# EAGLE design ControlBoard (EAGLE 9.6.2)
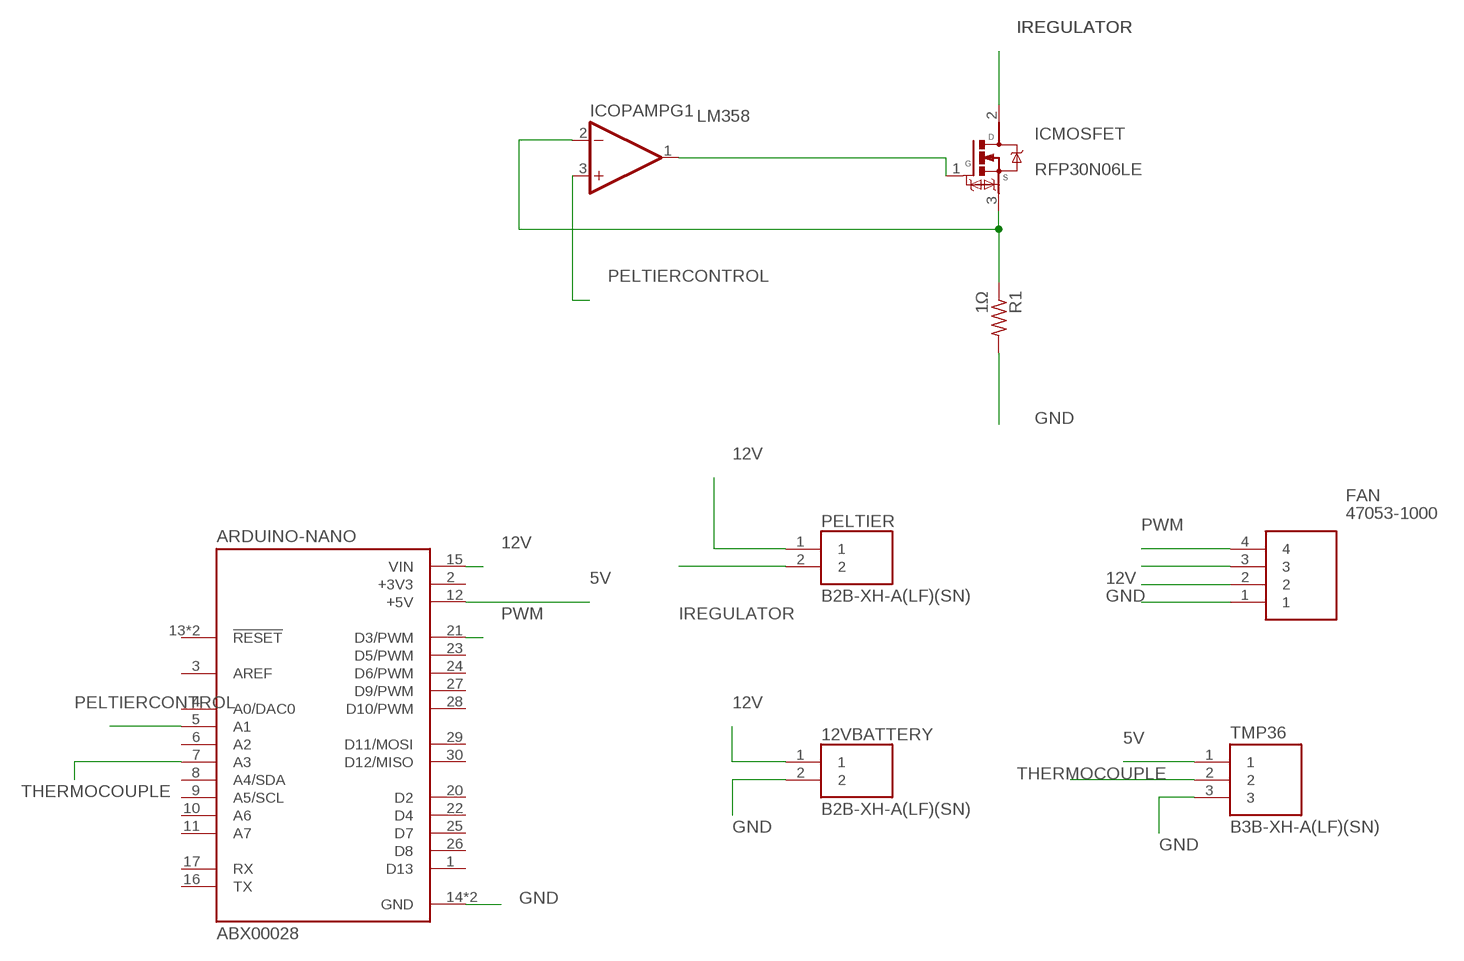
[diagram p0: schematic, sheet 1]

## Parts
12VBATTERY  B2B-XH-A(LF)(SN)  [JST_B2B-XH-A(LF)(SN)]
ARDUINO-NANO  ABX00028  [MODULE_ABX00028]
FAN  47053-1000  [470531000]
ICMOSFET  RFP30N06LE  [TRANS_RFP30N06LE]
ICOPAMP  LM358  [DIP08]
PELTIER  B2B-XH-A(LF)(SN)  [JST_B2B-XH-A(LF)(SN)]
R1  1Ω  FLIPFLOP-RES  [0805-THM]
TMP36  B3B-XH-A(LF)(SN)  [JST_B3B-XH-A(LF)(SN)]

## Nets
5V: ARDUINO-NANO.12(+5V) TMP36.1
12V: 12VBATTERY.1 ARDUINO-NANO.15(VIN) FAN.2 PELTIER.1
GND: 12VBATTERY.2 ARDUINO-NANO.14(GND) ARDUINO-NANO.19(GND) FAN.1 R1.2 TMP36.3
IREGULATOR: ICMOSFET.2(D) PELTIER.2
N$1: ICMOSFET.3(S) ICOPAMP.2(-IN) R1.1
N$3: FAN.3
N$5: ICMOSFET.1(G) ICOPAMP.1(OUT)
PELTIERCONTROL: ARDUINO-NANO.5(A1) ICOPAMP.3(+IN)
PWM: ARDUINO-NANO.21(D3/PWM) FAN.4
THERMOCOUPLE: ARDUINO-NANO.7(A3) TMP36.2
Unconnected: ARDUINO-NANO.1(D13) ARDUINO-NANO.3(AREF) ARDUINO-NANO.4(A0/DAC0) ARDUINO-NANO.6(A2) ARDUINO-NANO.8(A4/SDA) ARDUINO-NANO.9(A5/SCL) ARDUINO-NANO.10(A6) ARDUINO-NANO.11(A7) ARDUINO-NANO.13(!RESET) ARDUINO-NANO.16(TX) ARDUINO-NANO.17(RX) ARDUINO-NANO.18(!RESET) ARDUINO-NANO.20(D2) ARDUINO-NANO.22(D4) ARDUINO-NANO.23(D5/PWM) ARDUINO-NANO.24(D6/PWM) ARDUINO-NANO.25(D7) ARDUINO-NANO.26(D8) ARDUINO-NANO.27(D9/PWM) ARDUINO-NANO.28(D10/PWM) ARDUINO-NANO.29(D11/MOSI) ARDUINO-NANO.30(D12/MISO) ICOPAMP.4(P$V-) ICOPAMP.5(+IN) ICOPAMP.6(-IN) ICOPAMP.7(OUT) ICOPAMP.8(P$V+)

## Power pins joined to a net without a drawn wire
+3V3: ARDUINO-NANO.2(+3V3)

## Library data of the parts
12VBATTERY PELTIER = B2B-XH-A_LF__SN_:B2B-XH-A(LF)(SN): Connector Header Through Hole 2 position 0.098" (2.50mm) Check prices <https://pricing.snapeda.com/parts/B2B-XH-A%28LF%29%28SN%29/JST%20Sales/view-part?ref=eda> Check availability <https://pricing.snapeda.com/parts/B2B-XH-A%28LF%29%28SN%29/JST%20Sales/view-part?ref=eda>; AVAILABILITY: In Stock; DESCRIPTION: Connector Header Through Hole 2 position 0.098 (2.50mm); MF: JST Sales; MP: B2B-XH-A(LF)(SN); PACKAGE: None; PRICE: None; PURCHASE-URL: https://pricing.snapeda.com/search/part/B2B-XH-A(LF)(SN)/?ref=eda
ARDUINO-NANO = ABX00028:ABX00028: ATmega4809 Arduino Nano Every AVR AVR MCU 8-Bit Embedded Evaluation Board Check availability <https://pricing.snapeda.com/parts/Arduino%20Nano%20Every/Arduino/view-part?ref=eda>; AVAILABILITY: In Stock; DESCRIPTION: Arduino’s 5V compatible board in the smallest available form factor: 45x18mm!; MF: Arduino; MP: Arduino Nano Every; PACKAGE: None; PRICE: None; PURCHASE-URL: https://pricing.snapeda.com/search/part/Arduino Nano Every/?ref=eda
FAN = 47053-1000:47053-1000: MOLEX - 47053-1000 - HEADER, 4POS, 1ROW, 2.54MM Source: Datasheet <http://www.molex.com/pdm_docs/sd/470531000_sd.pdf> Check availability <https://pricing.snapeda.com/parts/470531000/Molex/view-part?ref=eda>; AVAILABILITY: In Stock; DESCRIPTION: Conn Wire to Board HDR 4 POS 2.54mm Solder ST Thru-Hole KK® Bag; MF: Molex; MP: 470531000; PACKAGE: None; PRICE: None; PURCHASE-URL: https://pricing.snapeda.com/search/part/470531000/?ref=eda
ICMOSFET = RFP30N06LE:RFP30N06LE: Mosfet n-Ch 60v 30a To-220ab - Rfp30n06le Check availability <https://pricing.snapeda.com/parts/RFP30N06LE/ON/view-part?ref=eda>; AVAILABILITY: Not in stock; DESCRIPTION: N-Channel 60 V 30A (Ta) 96W (Tc) Through Hole TO-220-3; MF: ON; MP: RFP30N06LE; PACKAGE: TO-220 Fairchild Semiconductor; PRICE: None
ICOPAMP = LM358:LM358: LM358 Jellybean op-amp Datasheet <http://www.sparkfun.com/datasheets/Components/General/LM358.pdf> SparkFun Products Op-Amp (Thru-Hole) - LM358 <https://www.sparkfun.com/products/9456> (COM-09456) Check availability <https://pricing.snapeda.com/parts/LM358/Texas%20Instruments/view-part?ref=eda>; AVAILABILITY: In Stock; DESCRIPTION: General Purpose Amplifier 2 Circuit - 8-TSSOP; MF: Texas Instruments; MP: LM358; PACKAGE: None; PRICE: None; PURCHASE-URL: https://pricing.snapeda.com/search/part/LM358/?ref=eda
R1 = adafruit:FLIPFLOP-RES: Flip Flop resistor An 0805 resistor inside a standard 1/4W 5% resistor. Makes for easy mods
TMP36 = B3B-XH-A_LF__SN_:B3B-XH-A(LF)(SN): Connector Header Through Hole 3 position 0.098" (2.50mm) Check prices <https://pricing.snapeda.com/parts/B3B-XH-A%28LF%29%28SN%29/JST%20Sales/view-part?ref=eda> Check availability <https://pricing.snapeda.com/parts/B3B-XH-A%28LF%29%28SN%29/JST%20Sales/view-part?ref=eda>; AVAILABILITY: In Stock; DESCRIPTION: Connector Header Through Hole 3 position 0.098 (2.50mm); MF: JST Sales; MP: B3B-XH-A(LF)(SN); PACKAGE: None; PRICE: None

## Board
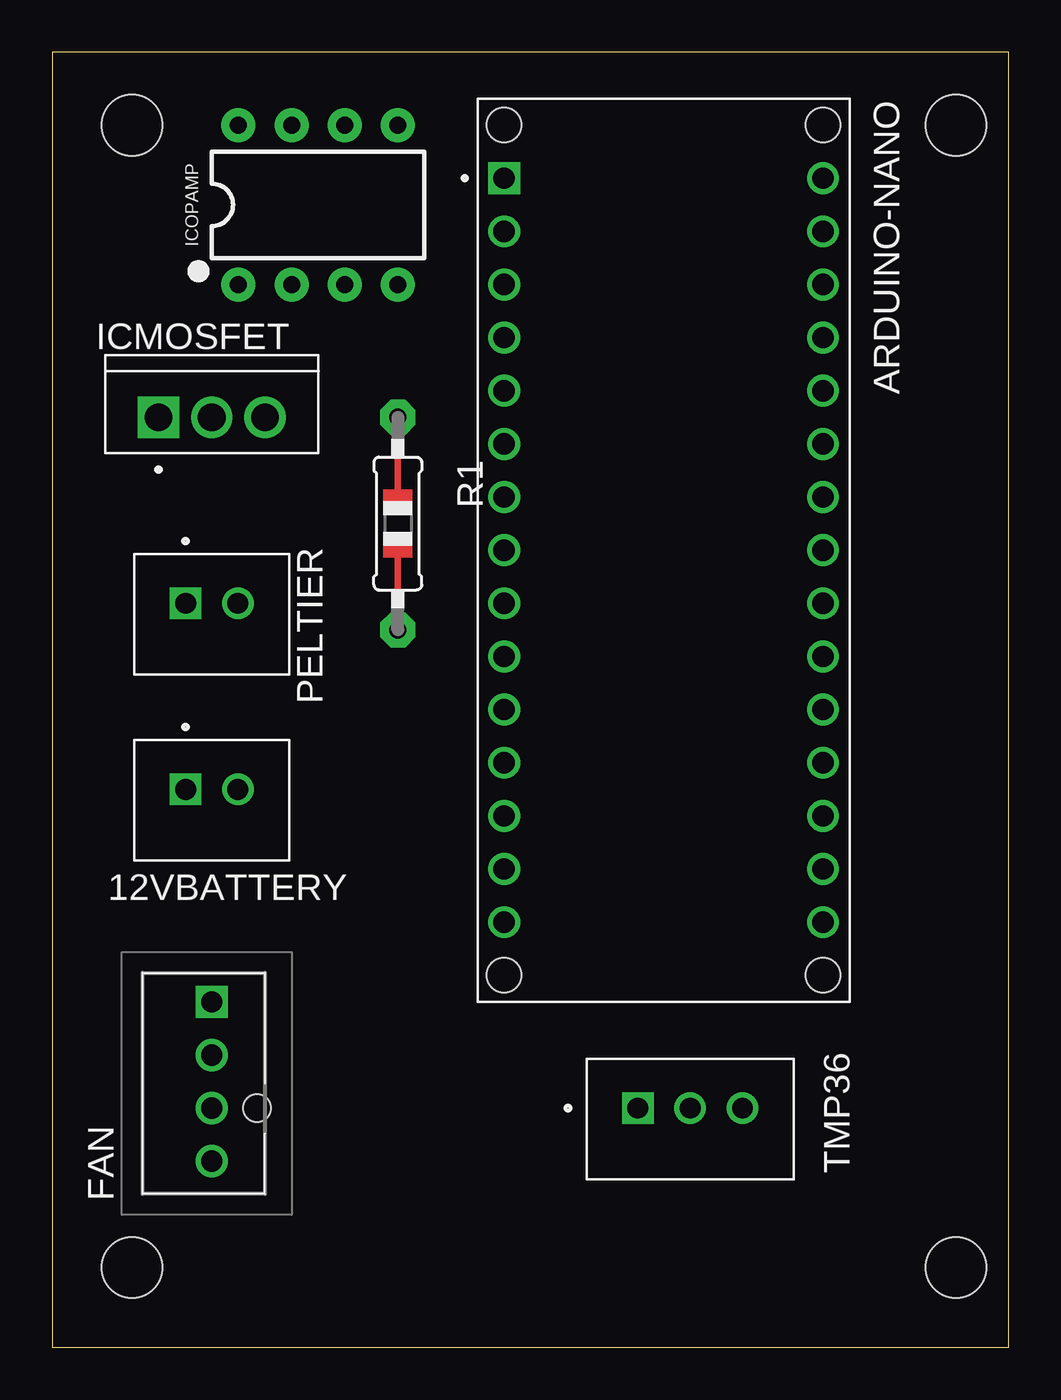
[diagram p1: board, top side]
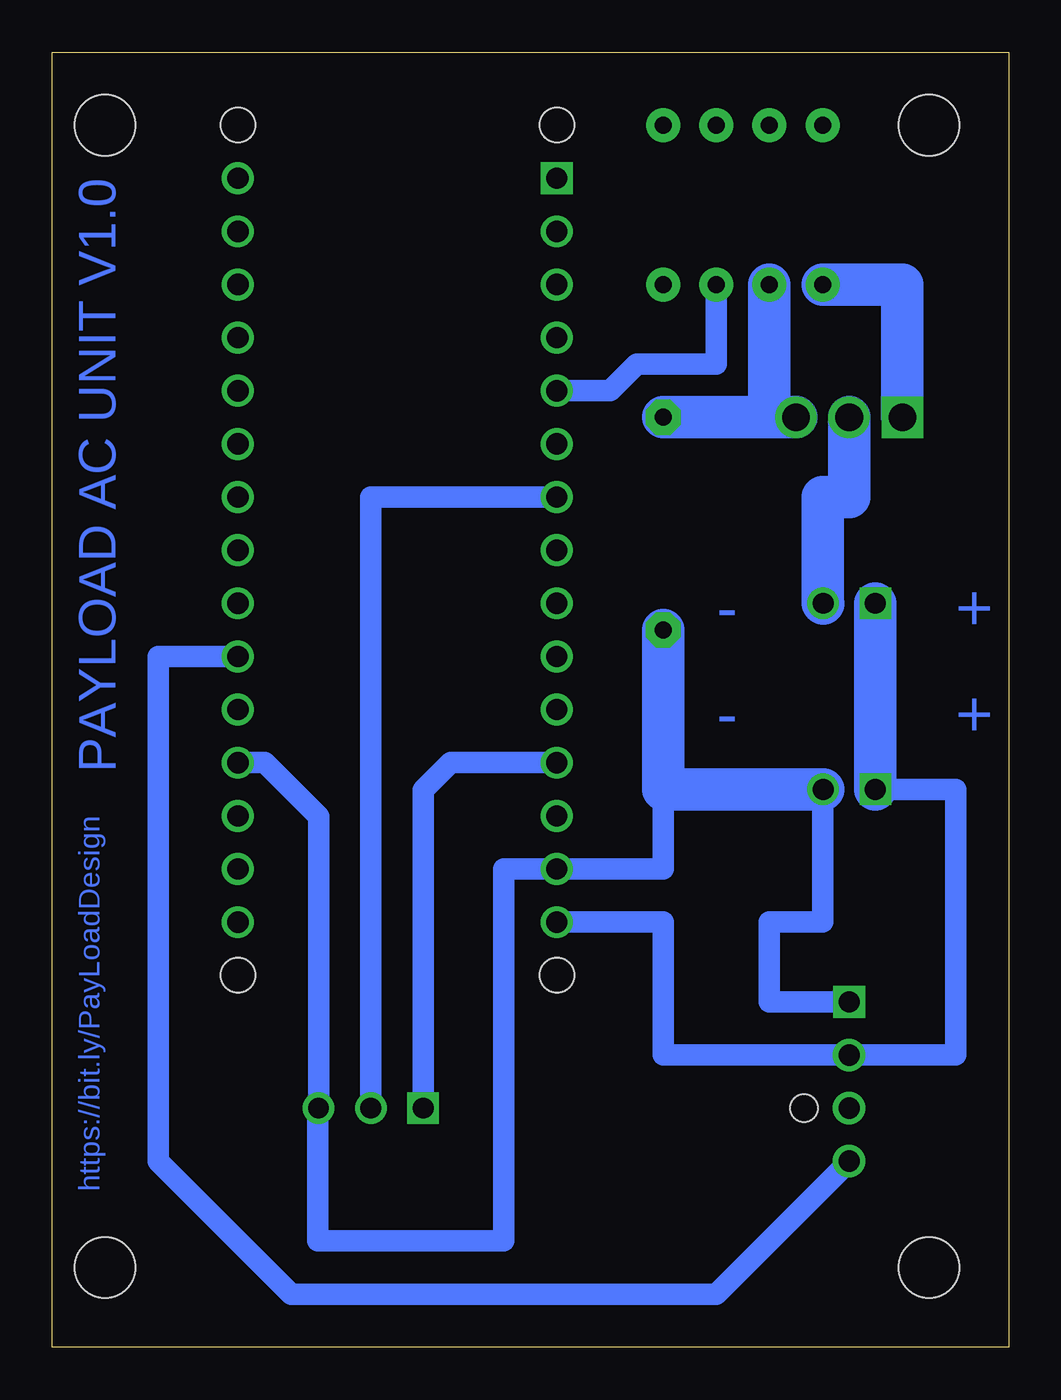
[diagram p2: board, bottom side, seen from below]

Size 45.7 x 61.9 mm. Coordinates in mm from the lower left corner, seen from the top.
Outline: 0,0 45.7,0 45.7,61.9 0,61.9 0,0
Copper layers (1*16): Top 0.035mm / dielectric 0.15mm / Bottom 0.035mm
Design rules "default": minimum track width 6mil, minimum drill 0.35mm, track to track 6mil, track to pad 6mil, pad to pad 6mil, via to via 6mil, smd to smd 6mil, copper to edge 40mil, drill to drill 6mil, minimum pad ring 10mil, minimum via ring 8mil, stop-mask expansion 4mil, vias tented up to drill 0mil, thermal gap 10mil
Holes 2.9 mm at 3.81,58.42 43.18,58.42 3.81,3.81 43.18,3.81

### Footprints (pad centres in the part's own frame; a part is rotated, then mirrored left to right if it is on the bottom)
JST_B2B-XH-A(LF)(SN) = drill 1 square: 1 1.25,0 | drill 1: 2 -1.25,0
MODULE_ABX00028 = drill 1.016 square: 1 -17.78,-7.62 | drill 1.016: 2 -15.24,-7.62; 3 -12.7,-7.62; 4 -10.16,-7.62; 5 -7.62,-7.62; 6 -5.08,-7.62; 7 -2.54,-7.62; 8 0,-7.62; 9 2.54,-7.62; 10 5.08,-7.62; 11 7.62,-7.62; 12 10.16,-7.62; 13 12.7,-7.62; 14 15.24,-7.62; 15 17.78,-7.62; 16 17.78,7.62; 17 15.24,7.62; 18 12.7,7.62; 19 10.16,7.62; 20 7.62,7.62; 21 5.08,7.62; 22 2.54,7.62; 23 0,7.62; 24 -2.54,7.62; 25 -5.08,7.62; 26 -7.62,7.62; 27 -10.16,7.62; 28 -12.7,7.62; 29 -15.24,7.62; 30 -17.78,7.62 | hole 1.651: -20.32,-7.62; -20.32,7.62; 20.32,7.62; 20.32,-7.62
470531000 = drill 1.02 pad 1.53 square: 1 0,0 | drill 1.02 pad 1.55: 2 -2.54,0; 3 -5.08,0; 4 -7.62,0 | hole 1.3: -5.08,-2.16
TRANS_RFP30N06LE = drill 1.32 square: 1 -2.54,0 | drill 1.32: 2 0,0; 3 2.54,0
DIP08 = drill 0.813 pad 1.626: 1 -3.81,-3.81; 2 -1.27,-3.81; 3 1.27,-3.81; 4 3.81,-3.81; 5 3.81,3.81; 6 1.27,3.81; 7 -1.27,3.81; 8 -3.81,3.81
0805-THM = drill 0.813 pad 1.676 octagon: 1 -5.08,0; 2 5.08,0
JST_B3B-XH-A(LF)(SN) = drill 1 square: 1 2.5,0 | drill 1: 2 0,0; 3 -2.5,0

### Placement (x,y rotation side)
12VBATTERY  7.62,26.67 180 top
ARDUINO-NANO  29.21,38.1 270 top
FAN  7.62,16.51 90 top
ICMOSFET  7.62,44.45 0 top
ICOPAMP  12.7,54.61 0 top
PELTIER  7.62,35.56 180 top
R1  16.51,39.37 270 top
TMP36  30.48,11.43 180 top

### Tracks (layer width: path | path; a pad name or v marks a point on that pad's centre or on a via)
5V
  Bottom 1.016: ARDUINO-NANO.12 26.67,27.94 27.98,26.63 TMP36.1
12V
  Bottom 1.016: ARDUINO-NANO.15 16.51,20.32 16.51,13.97 FAN.2 2.54,13.97 2.54,26.67 12VBATTERY.1
  Bottom 2.032: PELTIER.1 12VBATTERY.1
GND
  Bottom 1.016: ARDUINO-NANO.19 35.56,27.94 32.98,25.36 TMP36.3 33.02,11.39 33.02,5.08 24.13,5.08 24.13,22.86 ARDUINO-NANO.14 16.51,22.86 16.51,26.67 | 12VBATTERY.2 8.89,26.65 8.89,20.32 11.43,20.32 11.43,16.51 FAN.1
  Bottom 2.032: R1.2 16.51,26.67 12VBATTERY.2
IREGULATOR
  Bottom 2.032: ICMOSFET.2 7.62,40.64 8.89,40.64 8.89,35.58 PELTIER.2
N$1
  Bottom 2.032: ICMOSFET.3 11.43,44.45 | 11.43,44.45 R1.1 | ICOPAMP.2 11.43,44.45
N$5
  Bottom 2.032: ICOPAMP.1 5.08,50.8 ICMOSFET.1
PELTIERCONTROL
  Bottom 1.016: ICOPAMP.3 13.97,46.99 17.78,46.99 19.05,45.72 ARDUINO-NANO.5
PWM
  Bottom 1.016: ARDUINO-NANO.21 40.64,33.02 40.64,8.89 34.29,2.54 13.97,2.54 FAN.4
THERMOCOUPLE
  Bottom 1.016: ARDUINO-NANO.7 30.48,40.64 TMP36.2

### Text on the board
Bottom: PAYLOAD AC UNIT V1.0 | + | - | + | - | https://bit.ly/PayLoadDesign